# Altium schematic sheet 5_Wzmacniacz+Integrator.SchDoc
size A4
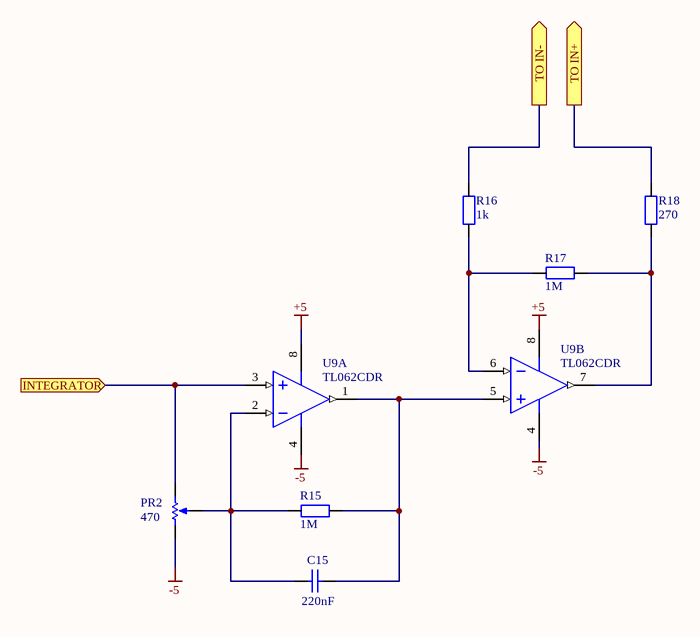
[diagram p0: 5_Wzmacniacz+Integrator.SchDoc]

## Parts
C15  Capacitance: 220nF  [KEMT-C315-THT-2]  (hidden comment: CM-220N@TME)
PR2  Resistance: 470  [BOUR-3296W]  (hidden comment: T910W-50R@TME)
R15  value 1M  [R1206]  (hidden comment: 1206S4J0105T5E@TME)
R16  value 1k  [R1206]  (hidden comment: 1206S4J0102T5E@TME)
R17  value 1M  [R1206]  (hidden comment: 1206S4J0105T5E@TME)
R18  value 270  [R1206]  (hidden comment: 1206S4J0271T5E@TME)
U9  TL062CDR  [D0008A_N]  (parts A,B of 2)

## Ports
INTEGRATOR (in), TO IN+ (out), TO IN- (out)

## Nets
+5: U9.8(VCC+)
-5: PR2.1(CCW) U9.4(VCC-)
INTEGRATOR: PR2.3(CW) U9.3(IN1+) ; port INTEGRATOR
TO IN+: R18.1 ; port TO IN+
TO IN-: R16.1 ; port TO IN-
NetC15_1: C15.1 PR2.2(S) R15.1 U9.2(IN1-)
NetC15_2: C15.2 R15.2 U9.1(OUT1) U9.5(IN2+)
NetR16_2: R16.2 R17.1 U9.6(IN2-)
NetR17_2: R17.2 R18.2 U9.7(OUT2)

## Library data of the parts
C15 = CMP-1664-00008-1: Model: C315C220K1G5TA; Max Input Voltage: 40 V; Min Input Voltage: 4.2 V; Output Current: 1.5 A; Output Voltage: 1.2 V; Outputs: 1; Case\Package: TO-220; RoHSCompliant: true; Min Operating Temperature: 0 degC; Max Operating Temperature: 125 degC; Package Quantity: 50; ComponentLink2URL: http://capacitoredge.kemet.com/capedge2/DataSheet/Datasheet-C315C220K1G5TA.pdf?pn=C315C220K1G5TA{BULK}; Radiation Hardening: No; Pins: 3; Length: 10.28 mm; ComponentLink1URL: http://www.kemet.com/; ComponentLink2Description: Datasheet; Height: 9.28 mm; REACH SVHC: No SVHC; ComponentLink1Description: Manufacturer URL; Max Ouput Current: 1.5 A; Weight: 0.08113 oz; Packaging: Rail/Tube; DatasheetVersion: Aug-16; Mount: Through Hole; PackageReference: C315-THT-2; Width: 4.82 mm; PackageDescription: 2-Pin Through Hole Device, Body 3.81 x 2.54 mm
PR2 = CMP-1747-00001-1: Square Trimpot(R) Trimming Potentiometer, 10 KOhm, +/- 10%, 0.5 W, -55 to 125 degC, 3-Pin THD, RoHS, Tube; Voltage Rating: 75 V; Tolerance: 1%; Power Rating: 100 mW; Case\Package: 0603; Type (Resistor): Thick Film; PackageDescription: 3-Pin Through Hole Device, Body 9.53 x 4.83 mm, Pitch 2.54 mm; RoHSCompliant: true; Package Quantity: 5000; Case Code (Metric): 1608; PackageReference: 3296W; ComponentLink2Description: Datasheet; REACH SVHC: Unknown; Case Code (Imperial): 0603; ComponentLink1URL: http://www.bourns.com/; Width: 0.85 mm; Radiation Hardening: No; Min Operating Temperature: -55 degC; Mount: Surface Mount; ComponentLink1Description: Manufacturer URL; Max Operating Temperature: 155 degC; Weight: 7.1E-05 oz; Pins: 2; DatasheetVersion: May-16; Packaging: Tape and Reel; Height: 0.45 mm; Length: 1.55 mm; ComponentLink2URL: http://www.bourns.com/docs/Product-Datasheets/3296.pdf
R15-R18 = Res: Resistor
U9 = CMP-0017-00600-2: Dual Low-Power JFET-Input General-Purpose Operational Amplifier, 7 to 36 V, 0 to 70 degC, 8-pin SOIC (D8), Green (RoHS & no Sb/Br); Manufacturer: Texas Instruments; Number of Channels: 2; Total Supply Voltage(Max)(+5V is 5, +/-5V is 10): 36; Vn at 1kHz(Typ)(nV/rtHz): 42; Slew Rate(Typ)(V/us): 3.5; Iq per channel(Max)(mA): 0.25; Offset Drift(Typ)(uV/C): 10; Rating: Catalog; Vio (25C)(Max)(mV): 15; Sub Family: General Purpose Amplifier, High Supply Voltage Amplifier (>=30V), Low Power Amp (<=500uA); Total Supply Voltage(Min)(+5V is 5, +/-5V is 10): 7; CMRR(Min)(dB): 70; GBW(Typ)(MHz): 1; IIB(Max)(pA): 400; ComponentLink2URL: http://www.ti.com/lit/ds/symlink/tl062.pdf; Eco-Plan: Green (RoHS & no Sb/Br); Code_JEDEC: MS-012; ComponentLink3URL: http://www.ti.com/litv/pdf/msoi002j; PackageVersion: 4040047-3/M, 06/2011; Mounting Technology: Surface Mount; DatasheetVersion: SLOS078J; ComponentLink3Description: Package Specification; PartNumber: TL062CDR; ComponentLink2Description: Datasheet; PackageReference: D0008A; PackageDescription: 8-Pin Plastic Small Outline, Body 4.9 x 3.9 mm, Pitch 1.27 mm; ComponentLink1Description: Manufacturer URL; ComponentLink1URL: http://www.ti.com/